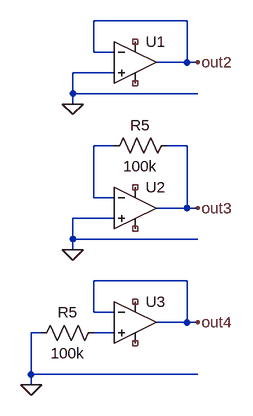
[diagram p0: schematic discrete-opamp3-fig2.asc]
discrete-opamp3-fig2.asc, the LTspice schematic file:
Version 4
SHEET 1 3556 680
WIRE 1344 -192 1200 -192
WIRE 1200 -144 1200 -192
WIRE 1232 -144 1200 -144
WIRE 1344 -128 1344 -192
WIRE 1344 -128 1296 -128
WIRE 1360 -128 1344 -128
WIRE 1232 -112 1168 -112
WIRE 1168 -80 1168 -112
WIRE 1360 -80 1168 -80
WIRE 1168 -64 1168 -80
WIRE 1232 0 1200 0
WIRE 1344 0 1312 0
WIRE 1200 80 1200 0
WIRE 1232 80 1200 80
WIRE 1344 96 1344 0
WIRE 1344 96 1296 96
WIRE 1360 96 1344 96
WIRE 1232 112 1168 112
WIRE 1168 144 1168 112
WIRE 1360 144 1168 144
WIRE 1168 160 1168 144
WIRE 1344 208 1200 208
WIRE 1200 256 1200 208
WIRE 1232 256 1200 256
WIRE 1344 272 1344 208
WIRE 1344 272 1296 272
WIRE 1360 272 1344 272
WIRE 1120 288 1104 288
WIRE 1232 288 1200 288
WIRE 1104 352 1104 288
WIRE 1360 352 1104 352
WIRE 1104 368 1104 352
FLAG 1168 -64 0
FLAG 1360 -128 out2
FLAG 1168 160 0
FLAG 1360 96 out3
FLAG 1104 368 0
FLAG 1360 272 out4
SYMBOL Opamps\\UniversalOpamp2 1264 -128 R0
SYMATTR InstName U1
SYMBOL Opamps\\UniversalOpamp2 1264 96 R0
SYMATTR InstName U2
SYMBOL res 1328 -16 R90
WINDOW 0 0 56 VBottom 2
WINDOW 3 32 56 VTop 2
SYMATTR InstName R5
SYMATTR Value 100k
SYMBOL Opamps\\UniversalOpamp2 1264 272 R0
SYMATTR InstName U3
SYMBOL res 1216 272 R90
WINDOW 0 0 56 VBottom 2
WINDOW 3 32 56 VTop 2
SYMATTR InstName R5
SYMATTR Value 100k

The netlist it stands for:
* discrete-opamp3-fig2.asc
XU1 0 out2 NC_01 NC_02 out2 level.2 Avol=1Meg GBW=10Meg Slew=10Meg ilimit=25m rail=0 Vos=0 phimargin=45 en=0 enk=0 in=0 ink=0 Rin=500Meg  ; pins IN+ IN- V+ V- OUT
XU2 0 N001 NC_03 NC_04 out3 level.2 Avol=1Meg GBW=10Meg Slew=10Meg ilimit=25m rail=0 Vos=0 phimargin=45 en=0 enk=0 in=0 ink=0 Rin=500Meg  ; pins IN+ IN- V+ V- OUT
R5 out3 N001 100k
XU3 N002 out4 NC_05 NC_06 out4 level.2 Avol=1Meg GBW=10Meg Slew=10Meg ilimit=25m rail=0 Vos=0 phimargin=45 en=0 enk=0 in=0 ink=0 Rin=500Meg  ; pins IN+ IN- V+ V- OUT
R5 N002 0 100k
.lib UniversalOpamps2.sub
.backanno
.end